# Altium schematic sheet Capacitor Isolated Supply (Bipolar).SchDoc
size A4
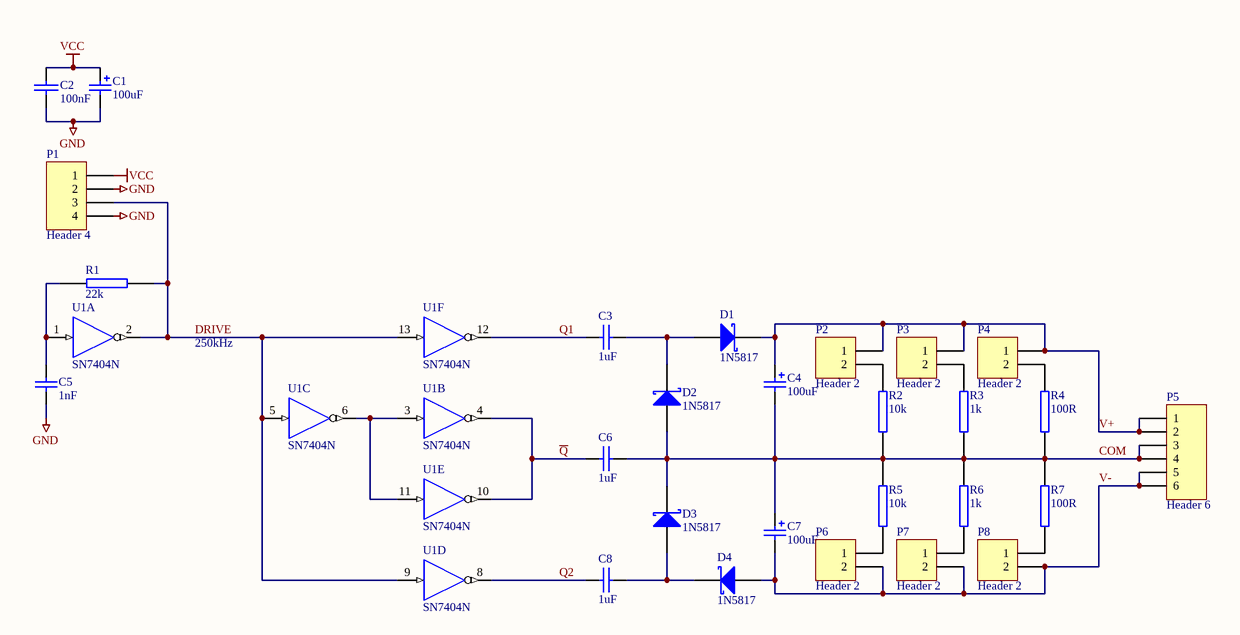
[diagram p0: Capacitor Isolated Supply (Bipolar).SchDoc]

## Parts
C1  100uF  [RB5-10.5]
C2  100nF  [CAP (3D) - 0805]
C3  1uF  [RES (3D) - 1210]
C4  100uF  [RB5-10.5]
C5  value 1nF  [CAP (3D) - 0805]  (hidden comment: Cap)
C6  1uF  [RES (3D) - 1210]
C7  100uF  [RB5-10.5]
C8  1uF  [RES (3D) - 1210]
D1  1N5817  [DO-41]
D2  1N5817  [DO-41]
D3  1N5817  [DO-41]
D4  1N5817  [DO-41]
P1  Header 4  [HDR1X4]
P2  Header 2  [HDR1X2]
P3  Header 2  [HDR1X2]
P4  Header 2  [HDR1X2]
P5  Header 6  [HDR1X6]
P6  Header 2  [HDR1X2]
P7  Header 2  [HDR1X2]
P8  Header 2  [HDR1X2]
R1  22k  [RES (3D) - 0805]
R2  10k  [RES (3D) - 0805]
R3  1k  [RES (3D) - 0805]
R4  100R  [RES (3D) - 0805]
R5  10k  [RES (3D) - 0805]
R6  1k  [RES (3D) - 0805]
R7  100R  [RES (3D) - 0805]
U1  SN7404N  [N014]  (parts A,B,C,D,E,F of 6)

## Nets
GND: C1.2 C2.2 C5.2 P1.2 P1.4 U1.7(GND)
VCC: C1.1 C2.1 P1.1 U1.14(VCC)
COM: C4.2 C6.2 C7.1 D2.1(A) D3.2(K) P5.3 P5.4 R2.1 R3.1 R4.1 R5.2 R6.2 R7.2
DRIVE: P1.3 R1.1 U1.2(Y) U1.5(A) U1.9(A) U1.13(A)
Q1: C3.1 U1.12(Y)
Q2: C8.1 U1.8(Y)
~{Q}: C6.1 U1.4(Y) U1.10(Y)
V+: C4.1 D1.2(K) P2.1 P3.1 P4.1 P5.1 P5.2
V-: C7.2 D4.1(A) P5.5 P5.6 P6.2 P7.2 P8.2
NetC3_2: C3.2 D1.1(A) D2.2(K)
NetC5_1: C5.1 R1.2 U1.1(A)
NetC8_2: C8.2 D3.1(A) D4.2(K)
NetP2_2: P2.2 R2.2
NetP3_2: P3.2 R3.2
NetP4_2: P4.2 R4.2
NetP6_1: P6.1 R5.1
NetP7_1: P7.1 R6.1
NetP8_1: P8.1 R7.1
NetU1_3: U1.3(A) U1.6(Y) U1.11(A)

## Notes on the sheet
- 250kHz

## Library data of the parts
C1 C4 C7 = Cap Pol: CAPACITOR POLARISED TAG B CASE; Manufacturer: Generic Components; Manufacturer Part No.: 293D106X9020B8T; value: 100uF; Mouser Part no.: 74-293D106X9020B8T; Web link: http://au.mouser.com/ProductDetail/Vishay-Sprague/293D106X9020B8T/?qs=sGAEpiMZZMukHu%252bjC5l7YZW4AlqROhXN47lkpjjQgHw%3d
C2 = CAP: CAPACITOR SMD 0603; Manufacturer: Murata; Manufacturer Part No.: GCM188R71C104KA37D; value: 100nF; Mouser Part no.: 81-GCM188R71C104KA7D; Web link: http://au.mouser.com/ProductDetail/Murata/GCM188R71C104KA37D/?qs=aEuGZpxfbxWKAxwYn%252beTMg%3d%3d
C3 C6 C8 = CAP: CAPACITOR SMD 0603; Manufacturer: Vishay; Manufacturer Part No.: VJ1206V105MXATW1BC; value: 1uF; Mouser Part no.: 77-VJ1206V105MXATBC; Web link: http://au.mouser.com/ProductDetail/Vishay-Vitramon/VJ1206V105MXATW1BC/?qs=sGAEpiMZZMsh%252b1woXyUXj%2f5vVgHgQOtXd6kjM69bn8k%3d
C5 = Cap: Capacitor; Published: 8-Jun-2000; LatestRevisionDate: 17-Jul-2002; LatestRevisionNote: Re-released for DXP Platform.; PackageReference: RAD-0.3; Publisher: Altium Limited; PackageDescription: Radial Cap, Thru-Hole; 2 Leads; 0.3 in Pin Spacing
D1-D4 = D Schottky: Schottky Diode; Published: 8-Jun-2000; LatestRevisionDate: 17-Jul-2002; LatestRevisionNote: Re-released for DXP Platform.; PackageReference: SMB; Publisher: Altium Limited; PackageDescription: DO-214-AA/SMB; 2 C-Bend Leads; Body 5.3 x 3.6 mm, inc. leads (LxW); Code_JEDEC: DO-214-AA
P1 = Header 4: Header, 4-Pin; LatestRevisionDate: 17-Jul-2002; LatestRevisionNote: Re-released for DXP Platform.; Publisher: Altium Limited
P2-P4 P6-P8 = Header 2: Header, 2-Pin; LatestRevisionDate: 17-Jul-2002; LatestRevisionNote: Re-released for DXP Platform.; Publisher: Altium Limited
P5 = Header 6: Header, 6-Pin; LatestRevisionDate: 17-Jul-2002; LatestRevisionNote: Re-released for DXP Platform.; Publisher: Altium Limited
R1-R7 = RES SMD 0603 10k: RESISTOR SMD 0603 10k
  R1: value: 22k
  R2 R5: value: 10k
  R3 R6: value: 1k
  R4 R7: value: 100R
U1 = SN7404N: Hex Inverter; Published: 8-Jun-2000; LatestRevisionDate: 04-Mar-2005; LatestRevisionNote: Stylized 3D Model Added.; DatasheetVersion: Mar-1988; PackageVersion: Oct-1995; PackageReference: N014; Publisher: Altium Limited; PackageDescription: DIP; 14 Leads; Row Spacing 7.62 mm; Pitch 2.54 mm; ComponentLink1Description: Manufacturer Link; ComponentLink1URL: http://www.ti.com/; ComponentLink2Description: Datasheet; ComponentLink2URL: http://www-s.ti.com/sc/ds/sn5404.pdf; ComponentLink3Description: Packaging Specification; ComponentLink3URL: http://focus.ti.com/lit/ml/mpdi002c/mpdi002c.pdf